# EasyEDA schematic PSU-to-BUS.json
TITLE: Sheet_1; REV: 1.0; Date: 2025-05-27; Sheet: 1/1; Drawn By: Unknownmephi; Company: Your Company
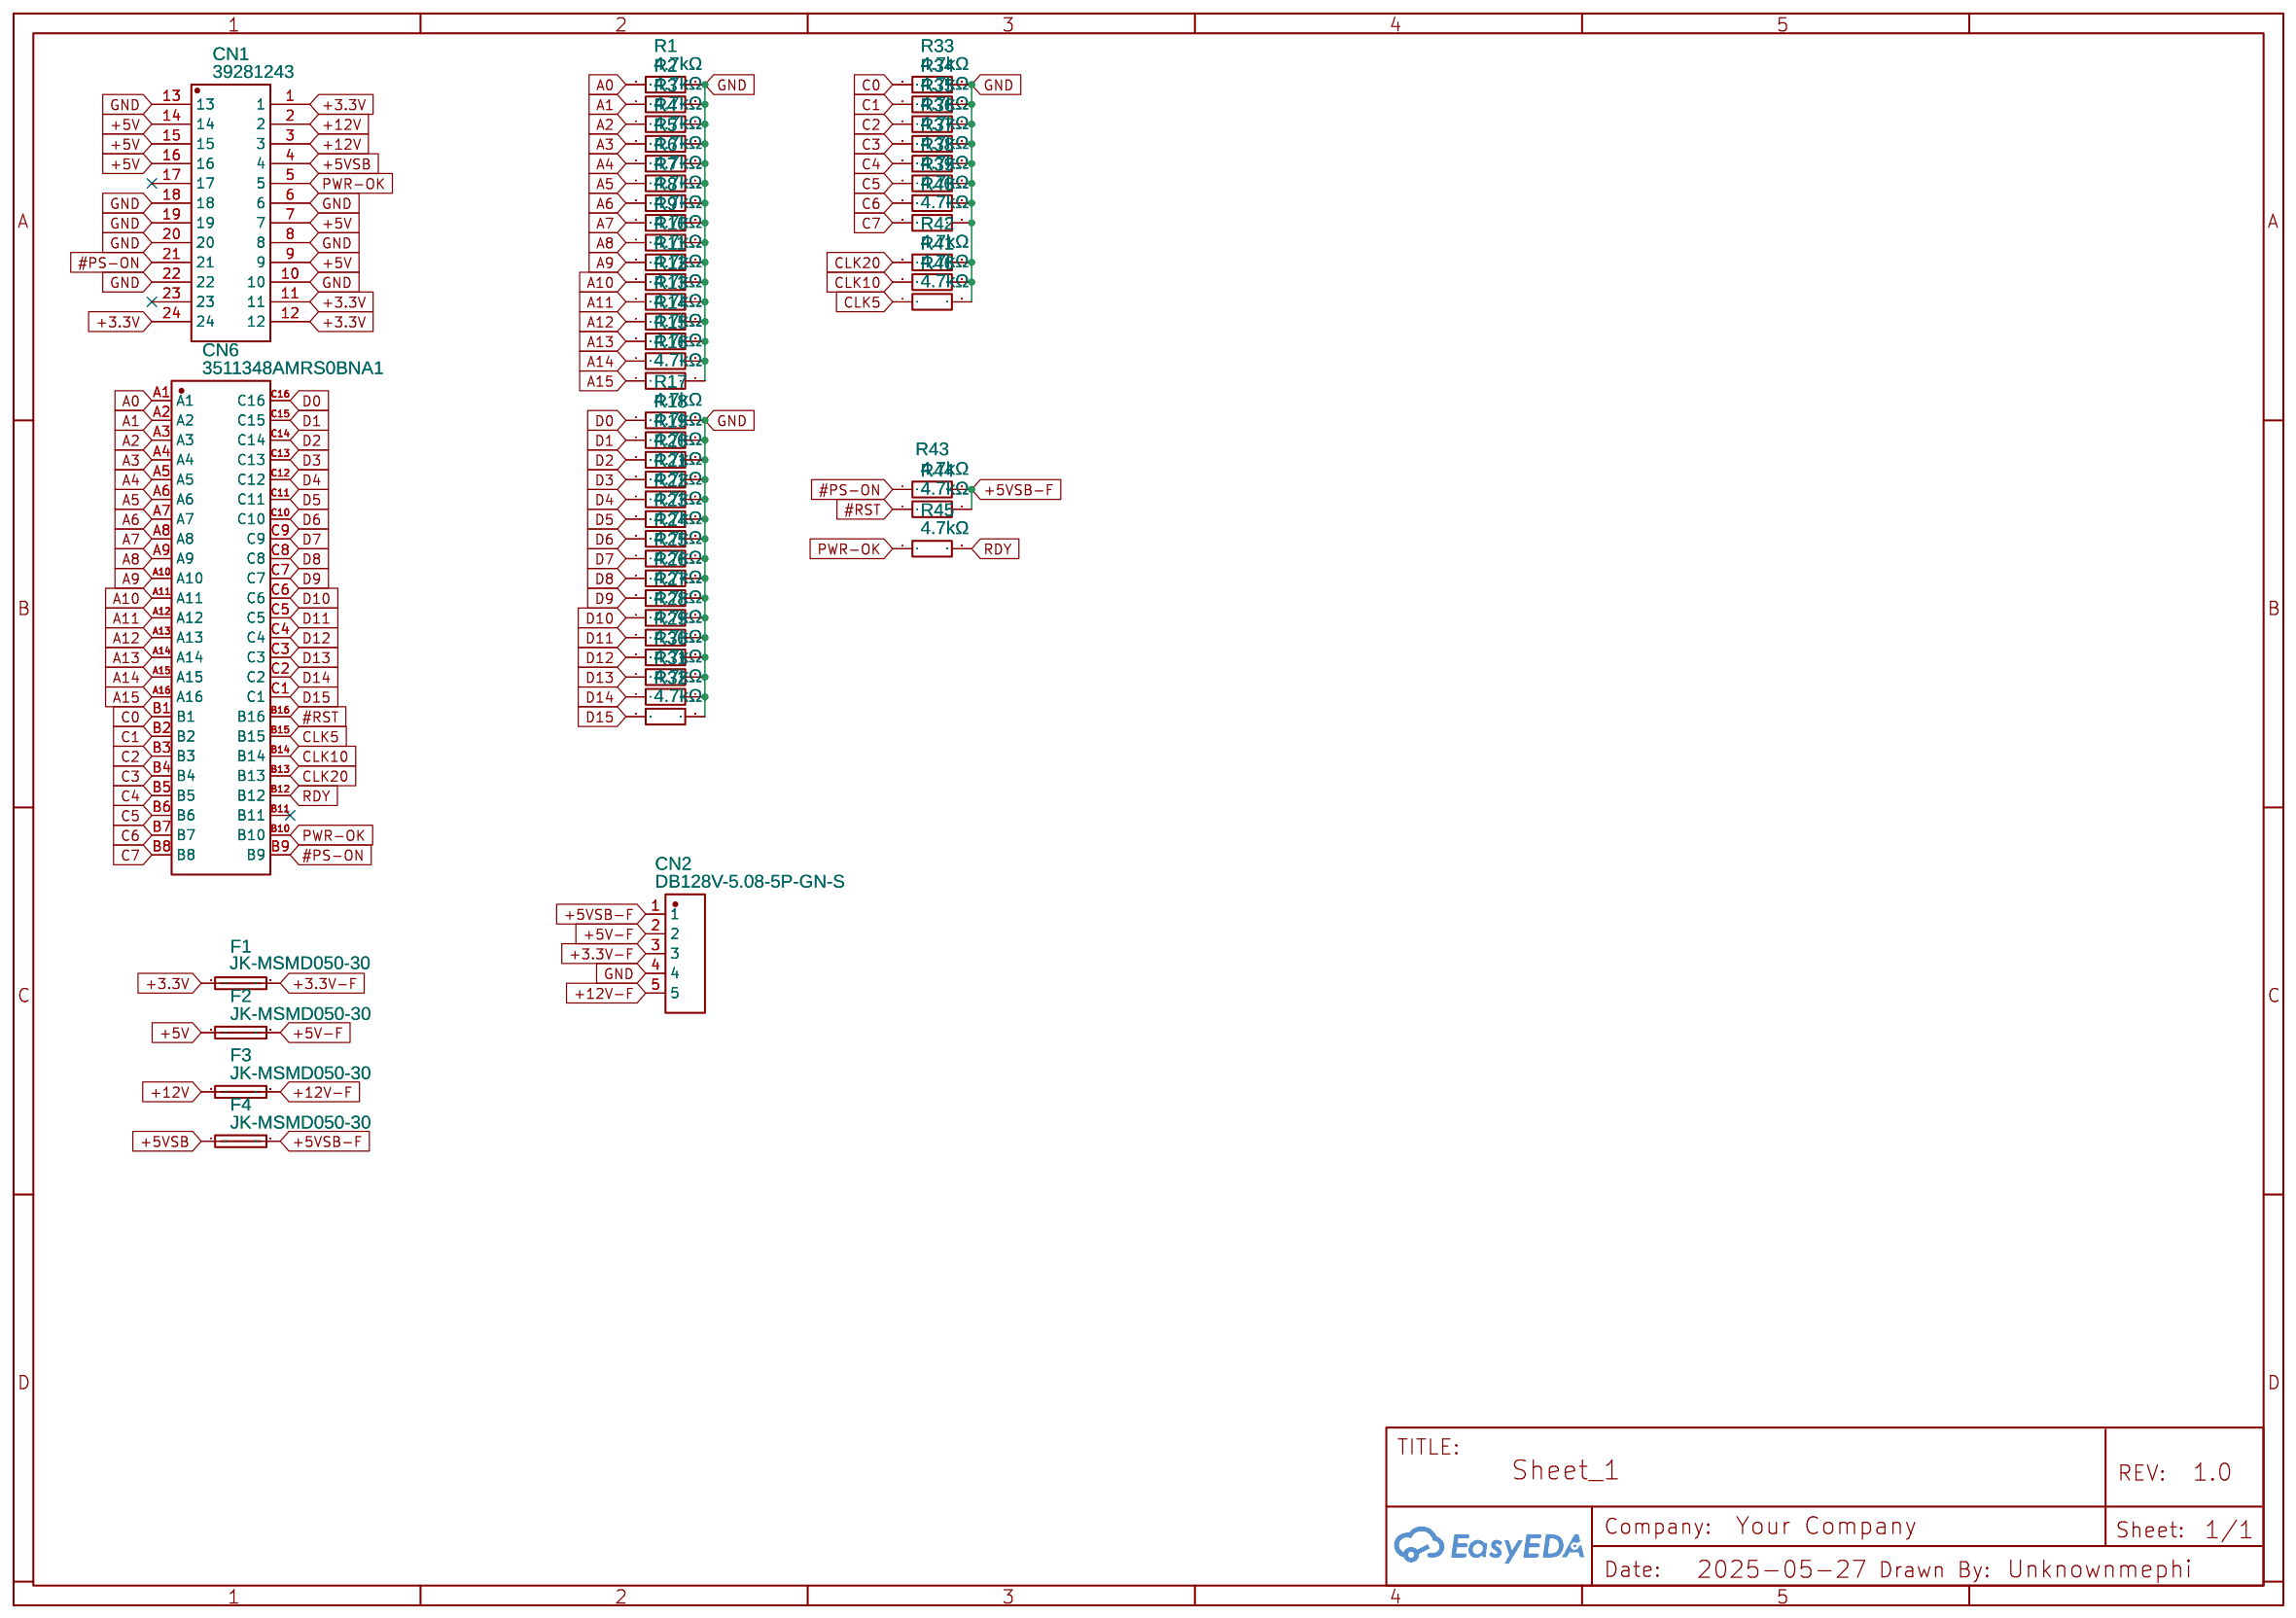
[diagram p0: schematic sheet]

## Parts
CN1  39281243  [CONN-TH_39281243]
CN2  DB128V-5.08-5P-GN-S  [CONN-TH_5P-P5.08_DIBO_DB128V-5.08-5P-GN-S]
CN6  3511348AMRS0BNA1  [CONN-TH_3511348AMRS0BNA1]
F1  JK-MSMD050-30  [F1812]
F2  JK-MSMD050-30  [F1812]
F3  JK-MSMD050-30  [F1812]
F4  JK-MSMD050-30  [F1812]
R1  4.7kΩ  [R0805]
R2  4.7kΩ  [R0805]
R3  4.7kΩ  [R0805]
R4  4.7kΩ  [R0805]
R5  4.7kΩ  [R0805]
R6  4.7kΩ  [R0805]
R7  4.7kΩ  [R0805]
R8  4.7kΩ  [R0805]
R9  4.7kΩ  [R0805]
R10  4.7kΩ  [R0805]
R11  4.7kΩ  [R0805]
R12  4.7kΩ  [R0805]
R13  4.7kΩ  [R0805]
R14  4.7kΩ  [R0805]
R15  4.7kΩ  [R0805]
R16  4.7kΩ  [R0805]
R17  4.7kΩ  [R0805]
R18  4.7kΩ  [R0805]
R19  4.7kΩ  [R0805]
R20  4.7kΩ  [R0805]
R21  4.7kΩ  [R0805]
R22  4.7kΩ  [R0805]
R23  4.7kΩ  [R0805]
R24  4.7kΩ  [R0805]
R25  4.7kΩ  [R0805]
R26  4.7kΩ  [R0805]
R27  4.7kΩ  [R0805]
R28  4.7kΩ  [R0805]
R29  4.7kΩ  [R0805]
R30  4.7kΩ  [R0805]
R31  4.7kΩ  [R0805]
R32  4.7kΩ  [R0805]
R33  4.7kΩ  [R0805]
R34  4.7kΩ  [R0805]
R35  4.7kΩ  [R0805]
R36  4.7kΩ  [R0805]
R37  4.7kΩ  [R0805]
R38  4.7kΩ  [R0805]
R39  4.7kΩ  [R0805]
R40  4.7kΩ  [R0805]
R41  4.7kΩ  [R0805]
R42  4.7kΩ  [R0805]
R43  4.7kΩ  [R0805]
R44  4.7kΩ  [R0805]
R45  4.7kΩ  [R0805]
R46  4.7kΩ  [R0805]

## Library data of the parts
CN1 = 39281243: Contributor: LCSC; Supplier: LCSC; Manufacturer: MOLEX; Supplier Part: C114088; JLCPCB Part Class: Extended Part
CN2 = DB128V-5.08-5P-GN-S: Contributor: LCSC; Supplier: LCSC; Supplier Part: C2927513; Manufacturer: DORABO(地博电气); JLCPCB Part Class: Extended Part
CN6 = 3511348AMRS0BNA1: Contributor: LCSC; Supplier: LCSC; Supplier Part: C963719; Manufacturer: JILN(锦凌); JLCPCB Part Class: Extended Part; link: https://lcsc.com/eda_search?q=C963719&%26type=1&ref=editor
F1-F4 = JK-MSMD050-30: Contributor: LCSC; Supplier: LCSC; Supplier Part: C369168; Manufacturer: JK(金科); JLCPCB Part Class: Extended Part
R1-R46 = 0805W8F4701T5E: Supplier: LCSC; Manufacturer: UNI-ROYAL(厚声); Supplier Part: C17673; JLCPCB Part Class: Basic Part

## Nets
+3.3V: CN1.1 CN1.11 CN1.12 CN1.24 F1.1
+3.3V-F: CN2.3 F1.2
+5V: CN1.7 CN1.9 CN1.14 CN1.15 CN1.16 F2.1
+5V-F: CN2.2 F2.2
+5VSB: CN1.4 F4.1
+5VSB-F: CN2.1 F4.2 R43.2 R44.2
+12V: CN1.2 CN1.3 F3.1
+12V-F: CN2.5 F3.2
GND: CN1.6 CN1.8 CN1.10 CN1.13 CN1.18 CN1.19 CN1.20 CN1.22 CN2.4 R1.2 R2.2 R3.2 R4.2 R5.2 R6.2 R7.2 R8.2 R9.2 R10.2 R11.2 R12.2 R13.2 R14.2 R15.2 R16.2 R17.2 R18.2 R19.2 R20.2 R21.2 R22.2 R23.2 R24.2 R25.2 R26.2 R27.2 R28.2 R29.2 R30.2 R31.2 R32.2 R33.2 R34.2 R35.2 R36.2 R37.2 R38.2 R39.2 R40.2 R41.2 R42.2 R46.2
#PS-ON: CN1.21 CN6.B9 R43.1
#RST: CN6.B16 R44.1
A0: CN6.A1 R1.1
A1: CN6.A2 R2.1
A2: CN6.A3 R3.1
A3: CN6.A4 R4.1
A4: CN6.A5 R5.1
A5: CN6.A6 R6.1
A6: CN6.A7 R7.1
A7: CN6.A8 R8.1
A8: CN6.A9 R9.1
A9: CN6.A10 R10.1
A10: CN6.A11 R11.1
A11: CN6.A12 R12.1
A12: CN6.A13 R13.1
A13: CN6.A14 R14.1
A14: CN6.A15 R15.1
A15: CN6.A16 R16.1
C0: CN6.B1 R33.1
C1: CN6.B2 R34.1
C2: CN6.B3 R35.1
C3: CN6.B4 R36.1
C4: CN6.B5 R37.1
C5: CN6.B6 R38.1
C6: CN6.B7 R39.1
C7: CN6.B8 R40.1
CLK5: CN6.B15 R46.1
CLK10: CN6.B14 R41.1
CLK20: CN6.B13 R42.1
D0: CN6.C16 R17.1
D1: CN6.C15 R18.1
D2: CN6.C14 R19.1
D3: CN6.C13 R20.1
D4: CN6.C12 R21.1
D5: CN6.C11 R22.1
D6: CN6.C10 R23.1
D7: CN6.C9 R24.1
D8: CN6.C8 R25.1
D9: CN6.C7 R26.1
D10: CN6.C6 R27.1
D11: CN6.C5 R28.1
D12: CN6.C4 R29.1
D13: CN6.C3 R30.1
D14: CN6.C2 R31.1
D15: CN6.C1 R32.1
PWR-OK: CN1.5 CN6.B10 R45.1
RDY: CN6.B12 R45.2

Not connected (* = marked no-connect by the designer): CN1 17* 23*; CN6 B11*
